# Altium schematic sheet PCB_AirSENSE_v4.1.3.SchDoc
size A3; Organization: Altium Limited; Address1: L3, 12a Rodborough Rd; Address2: Frenchs Forest; Address3: NSW; Address4: Australia 2086; SheetNumber: 1; SheetTotal: 1
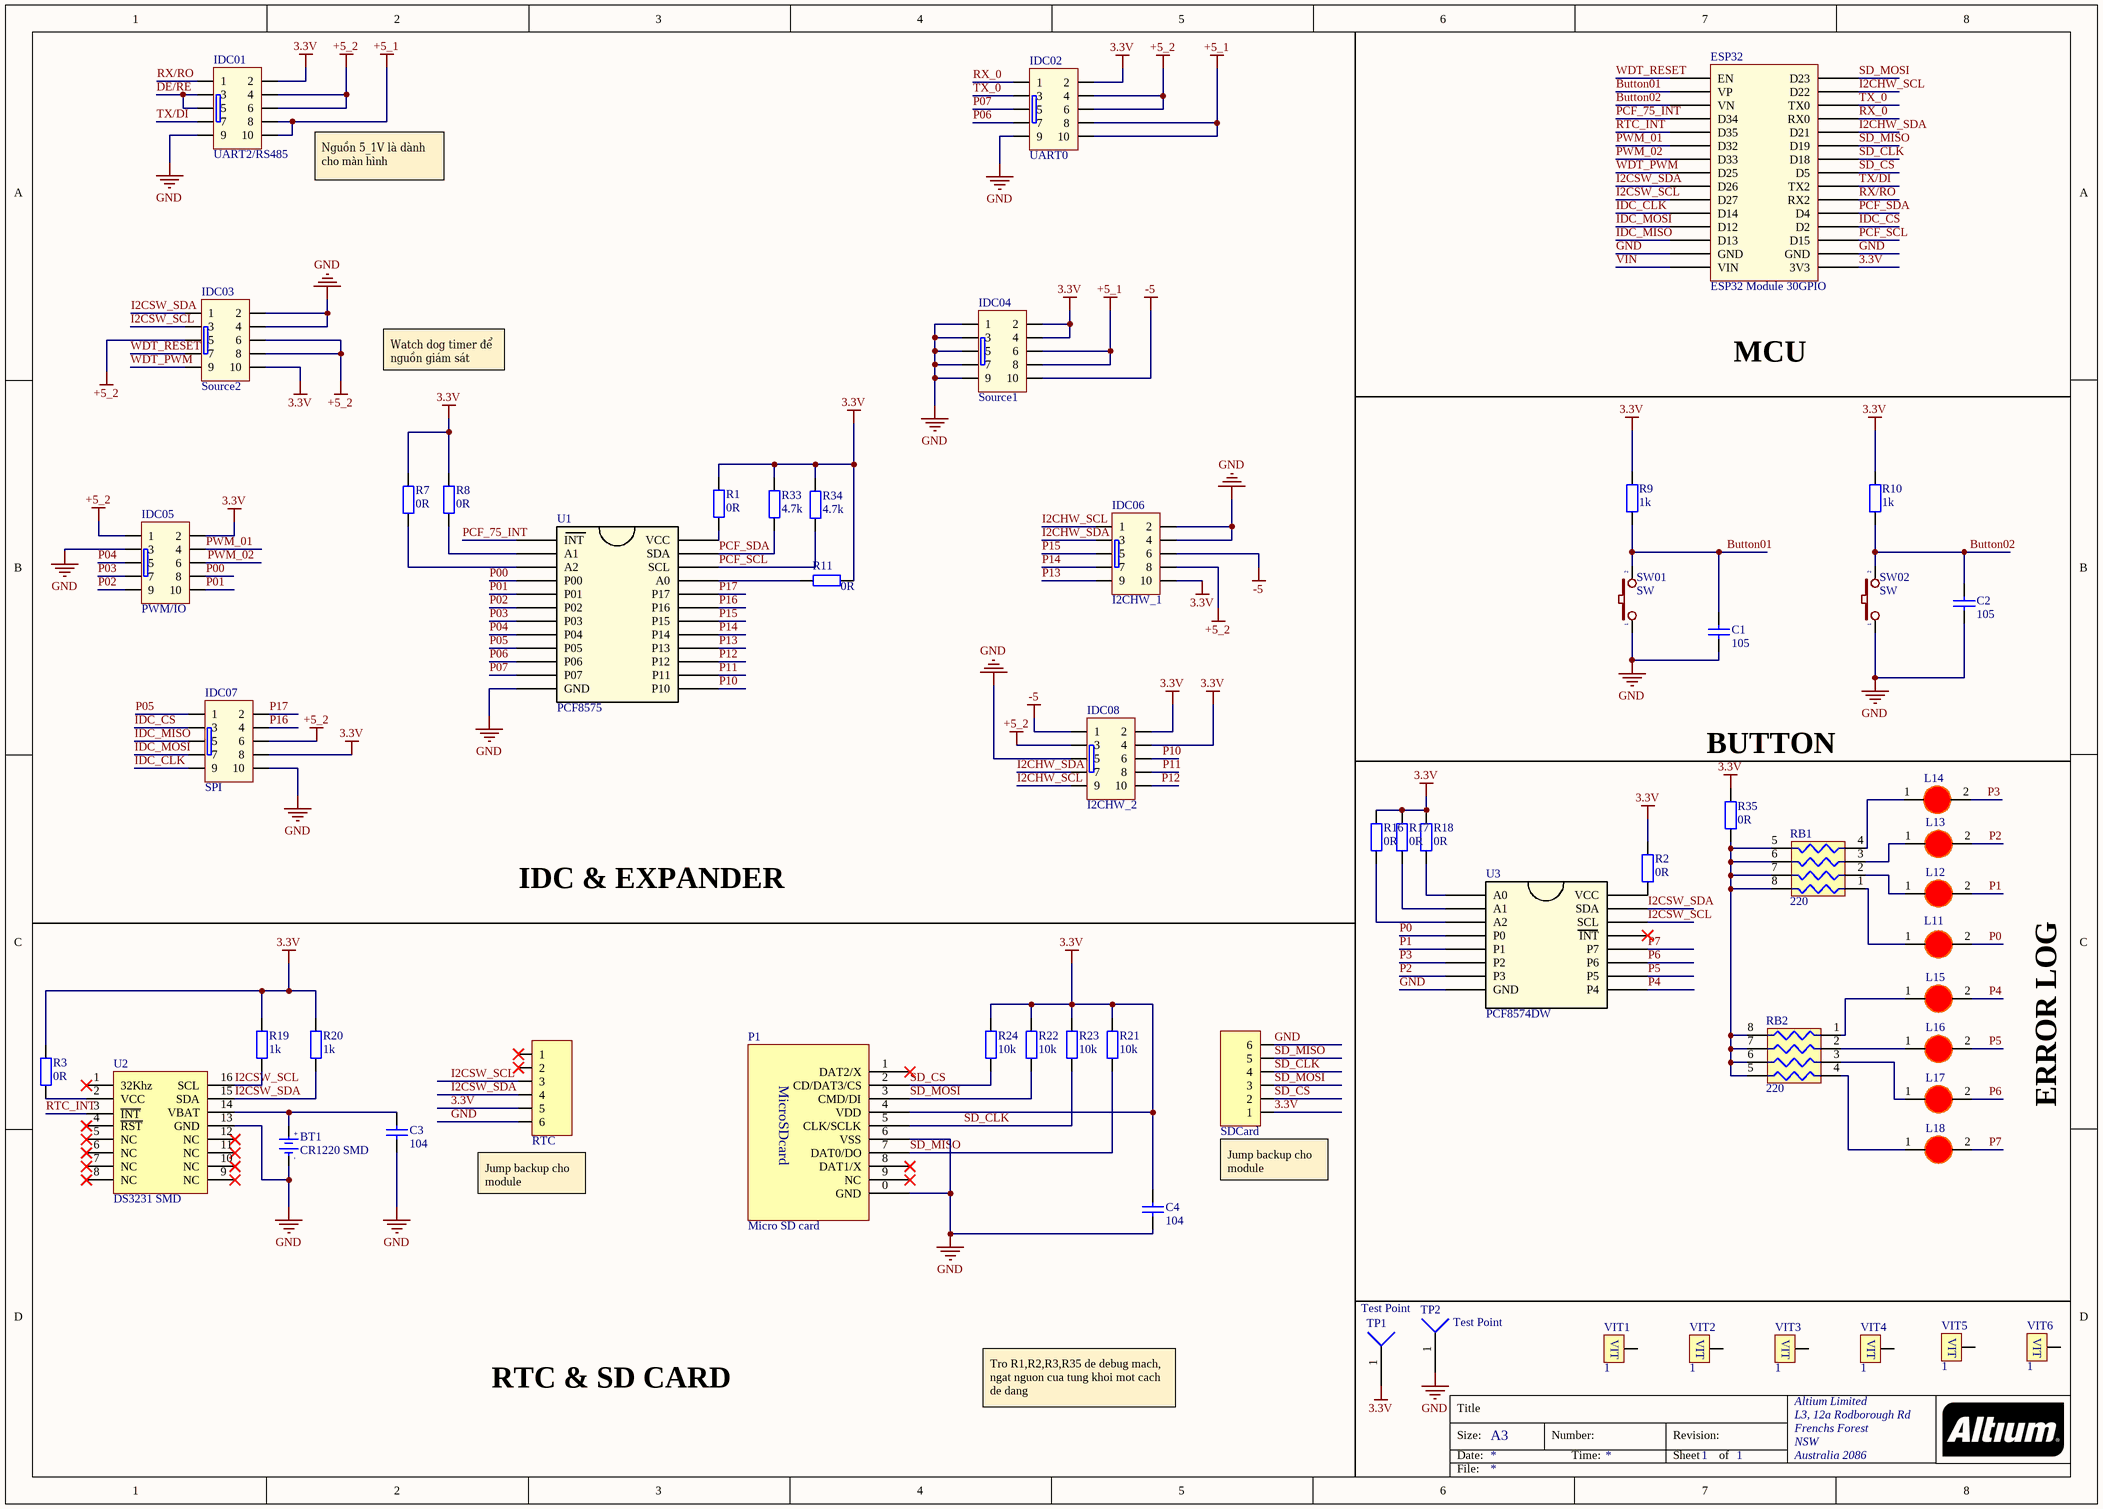
[diagram p0: PCB_AirSENSE_v4.1.3.SchDoc]

## Parts
BT1  CR1220 SMD  [DE PIN CR1220]
C1  105  [tu 0805]
C2  105  [tu 0805]
C3  104  [tu 0805]
C4  104  [tu 0805]
ESP32  ESP32 Module 30GPIO  [ESP32 Module 30GPIO_v3]
IDC01  UART2/RS485  [IDC10]
IDC02  UART0  [IDC10]
IDC03  Source2  [IDC10]
IDC04  Source1  [IDC10]
IDC05  PWM/IO  [IDC10]
IDC06  I2CHW_1  [IDC10]
IDC07  SPI  [IDC10]
IDC08  I2CHW_2  [IDC10]
JP3  SDCard  [JP 1x6 DT]
JP4  RTC  [JP 1x6 DT]
L11  LED 0805  [LED-0805-Red]  (value not drawn)
L12  LED 0805  [LED-0805-Red]  (value not drawn)
L13  LED 0805  [LED-0805-Red]  (value not drawn)
L14  LED 0805  [LED-0805-Red]  (value not drawn)
L15  LED 0805  [LED-0805-Red]  (value not drawn)
L16  LED 0805  [LED-0805-Red]  (value not drawn)
L17  LED 0805  [LED-0805-Red]  (value not drawn)
L18  LED 0805  [LED-0805-Red]  (value not drawn)
P1  Micro SD card  [MicroSD]
R1  0R  [tro smd 0805]
R2  0R  [tro smd 0805]
R3  0R  [tro smd 0805]
R7  0R  [tro smd 0805]
R8  0R  [tro smd 0805]
R9  1k  [tro smd 0805]
R10  1k  [tro smd 0805]
R11  0R  [tro smd 0805]
R16  0R  [tro smd 0805]
R17  0R  [tro smd 0805]
R18  0R  [tro smd 0805]
R19  1k  [tro smd 0805]
R20  1k  [tro smd 0805]
R21  10k  [tro smd 0805]
R22  10k  [tro smd 0805]
R23  10k  [tro smd 0805]
R24  10k  [tro smd 0805]
R33  4.7k  [tro smd 0805]
R34  4.7k  [tro smd 0805]
R35  0R  [tro smd 0805]
RB1  220  [tro bang 0603 4]
RB2  220  [tro bang 0603 4]
SW01  SW  [SW1-SMD]
SW02  SW  [SW1-SMD]
TP1  Test Point  [TEST_POINT_1.5X1.5MM]
TP2  Test Point  [TEST_POINT_1.5X1.5MM]
U1  PCF8575  [SSOP65P775X200-24N]
U2  DS3231 SMD  [SOIC 16]
U3  PCF8574DW  [PCF8574DW SOIC16]
VIT1  1  [VIT_3.7mm]
VIT2  1  [VIT_3.7mm]
VIT3  1  [VIT_3.7mm]
VIT4  1  [VIT_3.7mm]
VIT5  1  [VIT_3.7mm]
VIT6  1  [VIT_3.7mm]

## Nets
3.3V: C4.1 ESP32.15(3V3) IDC01.2 IDC02.2 IDC03.10 IDC04.2 IDC04.4 IDC05.2 IDC06.10 IDC07.8 IDC08.2 IDC08.4 JP3.1 JP4.5 P1.4(VDD) R1.2 R2.2 R3.2 R7.1 R8.1 R9.2 R10.2 R11.2 R16.1 R17.1 R18.1 R19.2 R20.2 R21.2 R22.2 R23.2 R24.2 R33.2 R34.2 R35.1 TP1.1
+5_1: IDC01.8 IDC01.10 IDC02.8 IDC02.10 IDC04.6 IDC04.8
+5_2: IDC01.4 IDC01.6 IDC02.4 IDC02.6 IDC03.5 IDC03.6 IDC03.8 IDC05.1 IDC06.8 IDC07.6 IDC08.3
-5: IDC04.10 IDC06.6 IDC08.1
GND: BT1.2(GND) C1.2 C2.2 C3.2 C4.2 ESP32.14(GND) ESP32.29(GND) IDC01.9 IDC02.9 IDC03.2 IDC03.4 IDC04.1 IDC04.3 IDC04.5 IDC04.7 IDC04.9 IDC05.3 IDC06.2 IDC06.4 IDC07.10 IDC08.5 JP3.6 JP4.6 P1.0(GND) P1.6(VSS) SW01.1 SW02.1 TP2.1 U1.12(GND) U2.13(GND) U3.8(GND)
Button01: C1.1 ESP32.17(VP) R9.1 SW01.2
Button02: C2.1 ESP32.18(VN) R10.1 SW02.2
DE/RE: IDC01.3 IDC01.5
I2CHW_SCL: ESP32.2(D22) IDC06.1 IDC08.9
I2CHW_SDA: ESP32.5(D21) IDC06.3 IDC08.7
I2CSW_SCL: ESP32.25(D27) IDC03.3 JP4.3 R19.1 U2.16(SCL) U3.14(SCL)
I2CSW_SDA: ESP32.24(D26) IDC03.1 JP4.4 R20.1 U2.15(SDA) U3.15(SDA)
IDC_CLK: ESP32.26(D14) IDC07.9
IDC_CS: ESP32.12(D2) IDC07.3
IDC_MISO: ESP32.28(D13) IDC07.5
IDC_MOSI: ESP32.27(D12) IDC07.7
P00: IDC05.8 U1.4(P00)
P0: L11.2(K) U3.4(P0)
P01: IDC05.10 U1.5(P01)
P1: L12.2(K) U3.5(P1)
P02: IDC05.9 U1.6(P02)
P2: L13.2(K) U3.7(P3)
P03: IDC05.7 U1.7(P03)
P3: L14.2(K) U3.6(P2)
P04: IDC05.5 U1.8(P04)
P4: L15.2(K) U3.9(P4)
P05: IDC07.1 U1.9(P05)
P5: L16.2(K) U3.10(P5)
P06: IDC02.7 U1.10(P06)
P6: L17.2(K) U3.11(P6)
P07: IDC02.5 U1.11(P07)
P7: L18.2(K) U3.12(P7)
P10: IDC08.6 U1.13(P10)
P11: IDC08.8 U1.14(P11)
P12: IDC08.10 U1.15(P12)
P13: IDC06.9 U1.16(P13)
P14: IDC06.7 U1.17(P14)
P15: IDC06.5 U1.18(P15)
P16: IDC07.4 U1.19(P16)
P17: IDC07.2 U1.20(P17)
PCF_75_INT: ESP32.19(D34) U1.1(INT)
PCF_SCL: ESP32.13(D15) R34.1 U1.22(SCL)
PCF_SDA: ESP32.11(D4) R33.1 U1.23(SDA)
PWM_01: ESP32.21(D32) IDC05.4
PWM_02: ESP32.22(D33) IDC05.6
RTC_INT: ESP32.20(D35) U2.3(~{INT})
RX/RO: ESP32.10(RX2) IDC01.1
RX_0: ESP32.4(RX0) IDC02.1
SD_CLK: ESP32.7(D18) JP3.4 P1.5(CLK/SCLK) R23.1
SD_CS: ESP32.8(D5) JP3.2 P1.2(CD/DAT3/CS) R24.1
SD_MISO: ESP32.6(D19) JP3.5 P1.7(DAT0/DO) R21.1
SD_MOSI: ESP32.1(D23) JP3.3 P1.3(CMD/DI) R22.1
TX/DI: ESP32.9(TX2) IDC01.7
TX_0: ESP32.3(TX0) IDC02.3
VIN: ESP32.30(VIN)
WDT_PWM: ESP32.23(D25) IDC03.9
WDT_RESET: ESP32.16(EN) IDC03.7
NetBT1_1: BT1.1(+3V) C3.1 U2.14(VBAT)
NetL11_1: L11.1(A) RB1.1
NetL12_1: L12.1(A) RB1.2
NetL13_1: L13.1(A) RB1.3
NetL14_1: L14.1(A) RB1.4
NetL15_1: L15.1(A) RB2.1
NetL16_1: L16.1(A) RB2.2
NetL17_1: L17.1(A) RB2.3
NetL18_1: L18.1(A) RB2.4
NetR1_1: R1.1 U1.24(VCC)
NetR2_1: R2.1 U3.16(VCC)
NetR3_1: R3.1 U2.2(VCC)
NetR7_2: R7.2 U1.3(A2)
NetR8_2: R8.2 U1.2(A1)
NetR11_1: R11.1 U1.21(A0)
NetR16_2: R16.2 U3.3(A2)
NetR17_2: R17.2 U3.2(A1)
NetR18_2: R18.2 U3.1(A0)
NetR35_2: R35.2 RB1.5 RB1.6 RB1.7 RB1.8 RB2.5 RB2.6 RB2.7 RB2.8

Not connected (* = marked no-connect by the designer): JP4 1* 2*; P1 1(DAT2/X)* 8(DAT1/X)* 9(NC)*; U2 1(32Khz)* 4(~{RST})* 5(NC)* 6(NC)* 7(NC)* 8(NC)* 9(NC)* 10(NC)* 11(NC)* 12(NC)*; U3 13(INT)*; VIT1 VIT1(1); VIT2 VIT1(1); VIT3 VIT1(1); VIT4 VIT1(1); VIT5 VIT1(1); VIT6 VIT1(1)

## Notes on the sheet
- (near IDC01) Nguồn 5_1V là dành cho màn hình
- Watch dog timer để nguồn giám sát MCU
- MCU
- (near R35) BUTTON
- IDC & EXPANDER
- ERROR LOG
- (near JP4) Jump backup cho module
- (near JP3) Jump backup cho module
- RTC & SD CARD
- Tro R1,R2,R3,R35 de debug mach, ngat nguon cua tung khoi mot cach de dang
- Title
- Size:
- Date:
- A3
- Number:
- Time:
- Revision:
- Sheet
- of
- File:
- (in symbol De pin CR1220 SMD) +; -
- (in symbol Micro SD card) MicroSDcard

## Library data of the parts
BT1 = De pin CR1220 SMD: Ten: Đế PIN CR1220 SMD; Ma_Hang: MH000833
C1-C4 = Tu 0805 105 50V 10%: Dán; Don_Vi: Con; So_Chan: 2; Ten_Linh_Kien: Tụ 0805 105-1uF 10% 50V; Ma_Hang: MH004552; Chung_Loai: Dán; Kieu_Chan: *
IDC01 IDC02 IDC03 IDC04 IDC05 IDC06 IDC07 IDC08 = IDC 5X2: Value: Header 5x2
JP3 JP4 = JP 1x6 2.54 Duc Thang: Cắm; Ten_Linh_Kien: Jump Đơn Đực 2.54MM 1x40P Thẳng 11MM; Don_Vi: Con; Ma_Hang: MH000903; Ghi_Chu: *; Kieu_Chan: *; Chung_Loai: Cắm
L11-L18 = LED 0805 Do: Dán; Don_Vi: Con; Ma_Hang: MH000897; Ten_Linh_Kien: LED 0805 Màu Đỏ (Red); Ghi_Chu: *; Kieu_Chan: *; Chung_Loai: Dán
R1-R3 R7-R11 R16-R18 R35 = Tro 0805 5% 0R: Dán; Don_Vi: Con; So_Chan: 2; Ten_Linh_Kien: Trở 0805 5% 0R; Ma_Hang: MH005230; Chung_Loai: Dán; Kieu_Chan: *
R19 R20 = Tro 0805 5% 1k: Dán; Don_Vi: Con; So_Chan: 2; Ten_Linh_Kien: Trở 0805 5% 1k; Ma_Hang: MH005234; Chung_Loai: Dán; Kieu_Chan: *
R21-R24 = Tro 0805 1% 10k: Dán; Don_Vi: Con; So_Chan: 2; Ten_Linh_Kien: Trở 0805 1% 10k; Ma_Hang: MH005473; Chung_Loai: Dán; Kieu_Chan: *
R33 R34 = Tro 0805 5% 4.7k: Dán; Don_Vi: Con; So_Chan: 2; Ten_Linh_Kien: Trở 0805 5% 4.7k; Ma_Hang: MH005307; Chung_Loai: Dán; Kieu_Chan: *
RB1 RB2 = Tro bang 0603 220R: Dán; Don_Vi: Con; So_Chan: 8; Ten_Linh_Kien: Trở băng 0603x4 220R; Ma_Hang: MH001450; Chung_Loai: Dán; Kieu_Chan: *
SW01 SW02 = SW2: Switch button 2 pin; Value: SW chip 2 pin
TP1 TP2 = Test Point: Ports: 1; Positions/Loaded: Port1 - 4/2; PerformanceCategory: 3; PCB_Mounting: Thru-Hole; PCB_Thickness: 0.125"; DrillSize: Nominal, Rounded to nearest 0.05mm; PCB_Layout: Complies with Manufacturer's Recommendation.; Published: 25-Jun-2002; DatasheetDocument: 20-Nov-2001; PackageDocument: 20-Nov-2001; PackageReference: 42878-4410; Publisher: Altium Limited; ComponentLink1Description: Manufacturer Link; ComponentLink1URL: http://www.molex.com/; ComponentLink2Description: Datasheet; ComponentLink2URL: http://www.molex.com/cmc_upload/common_files/1212003_42878catalogpage.pdf
U1 = PCF8575DW: PCF8575DW 24pins to expand I/O by I2C protocol (16bit)
U2 = DS3231 SMD: SOIC
U3 = PCF8574DW: PCF8574DW 16 pins to expand I/O by I2C protocol (8bit)
VIT1-VIT6 = VIT: Oc Vit